# EAGLE board ComputeCalculator (EAGLE 7.2.0), part 1 of 2
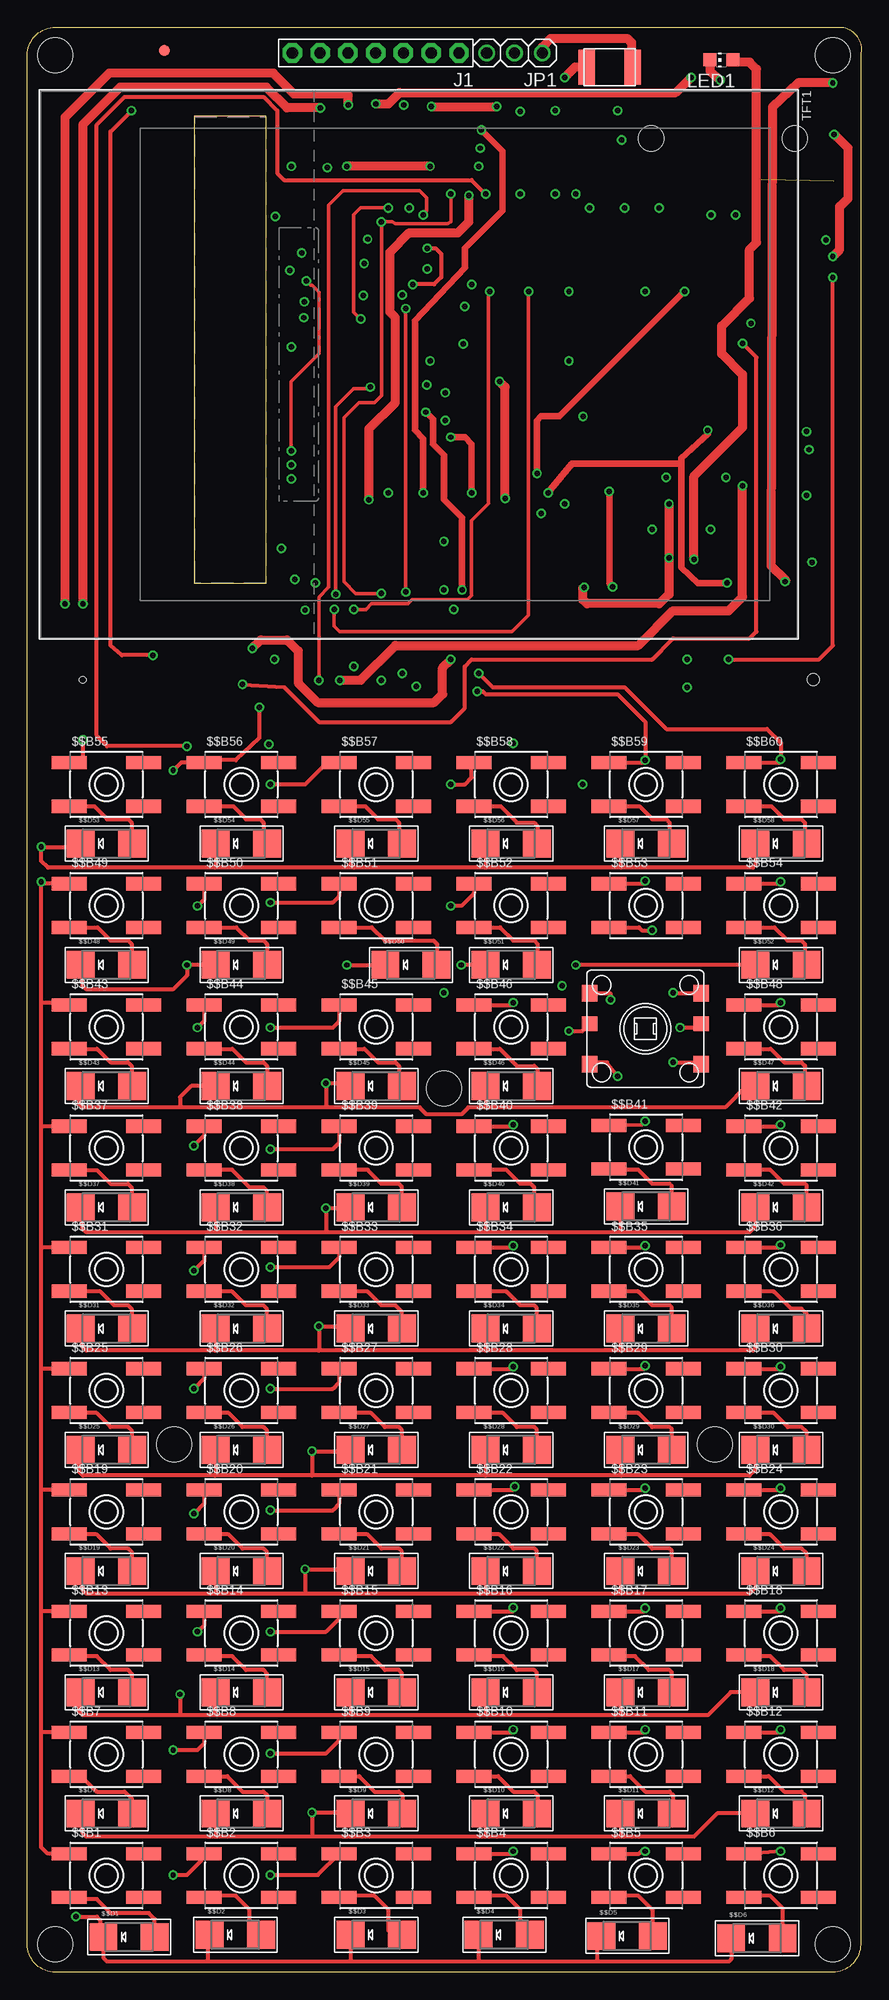
[diagram p5: board, top side]
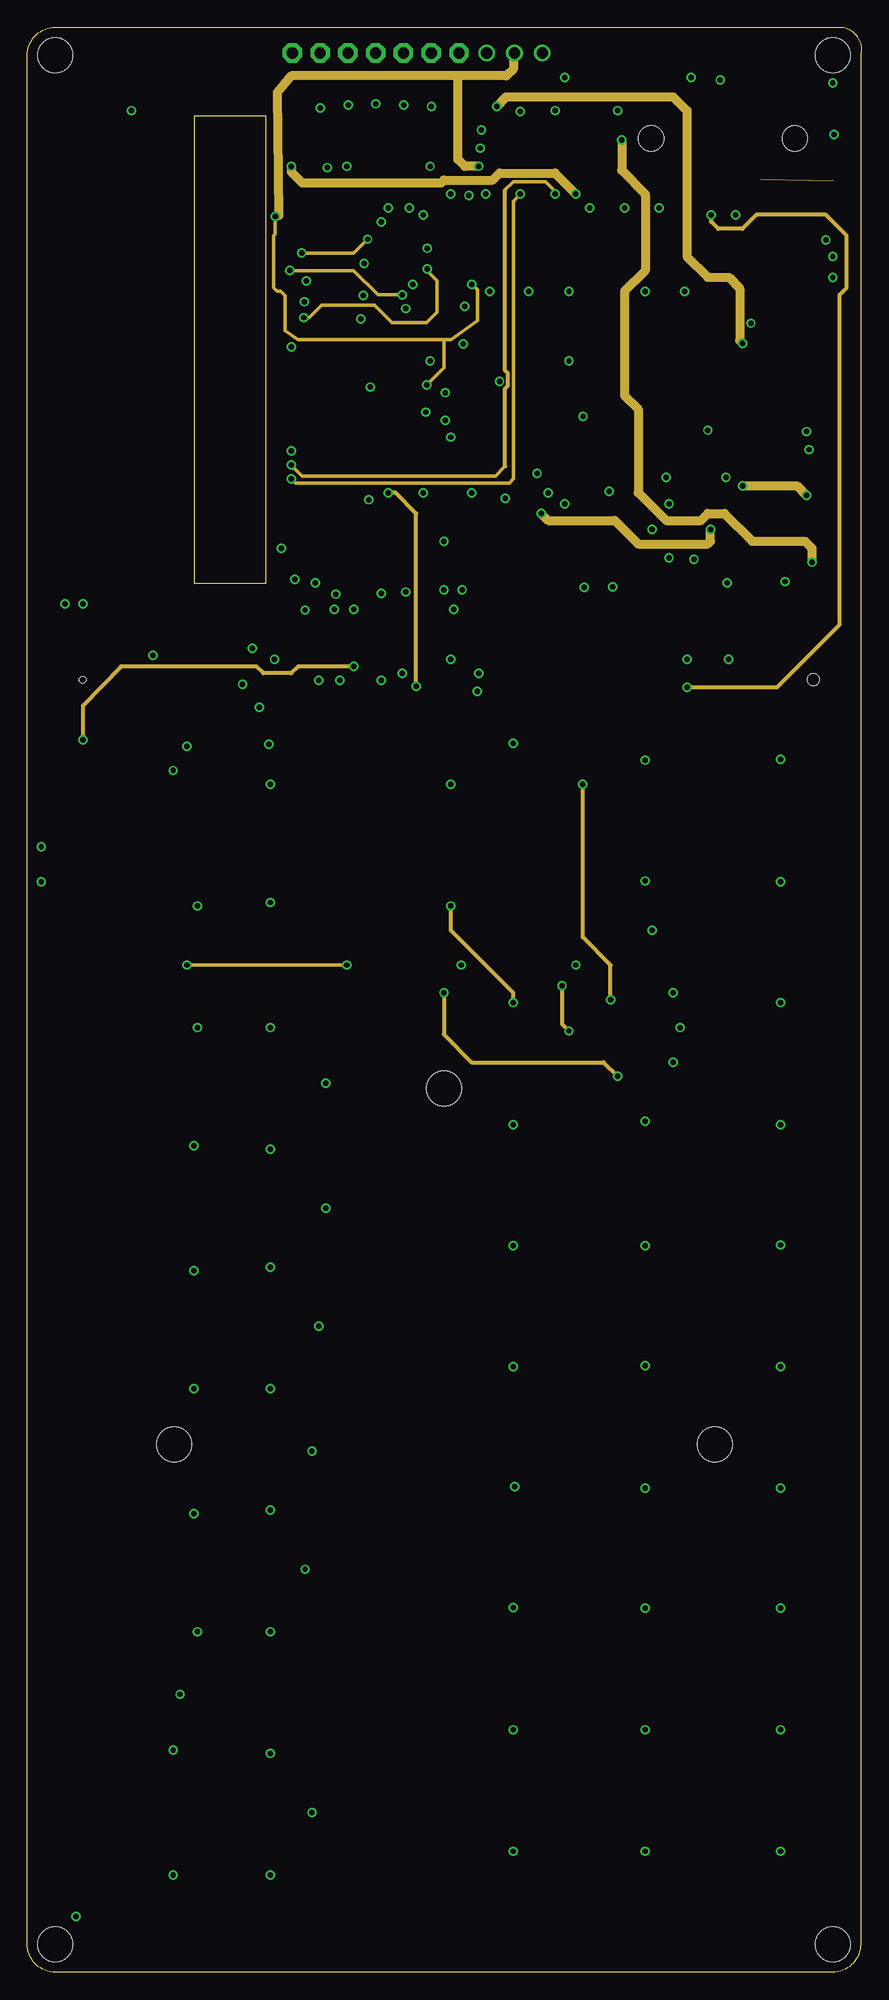
[diagram p6: board, inner layer Route2]
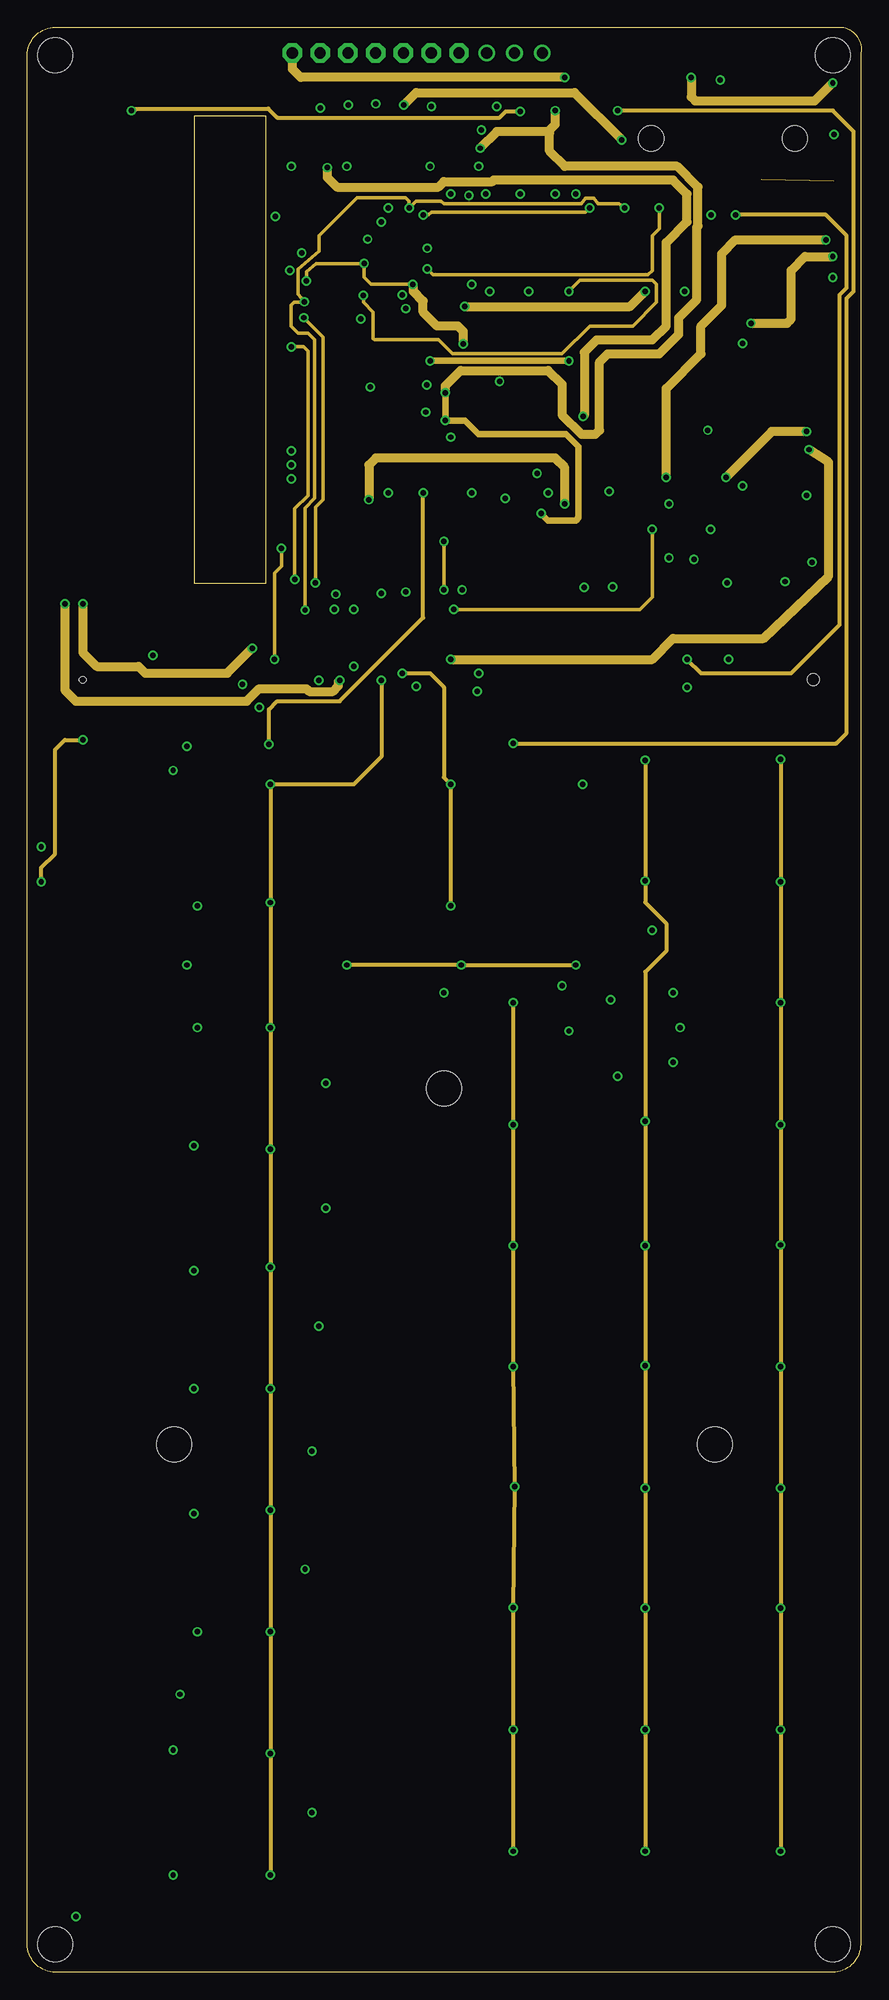
[diagram p7: board, inner layer Route15]
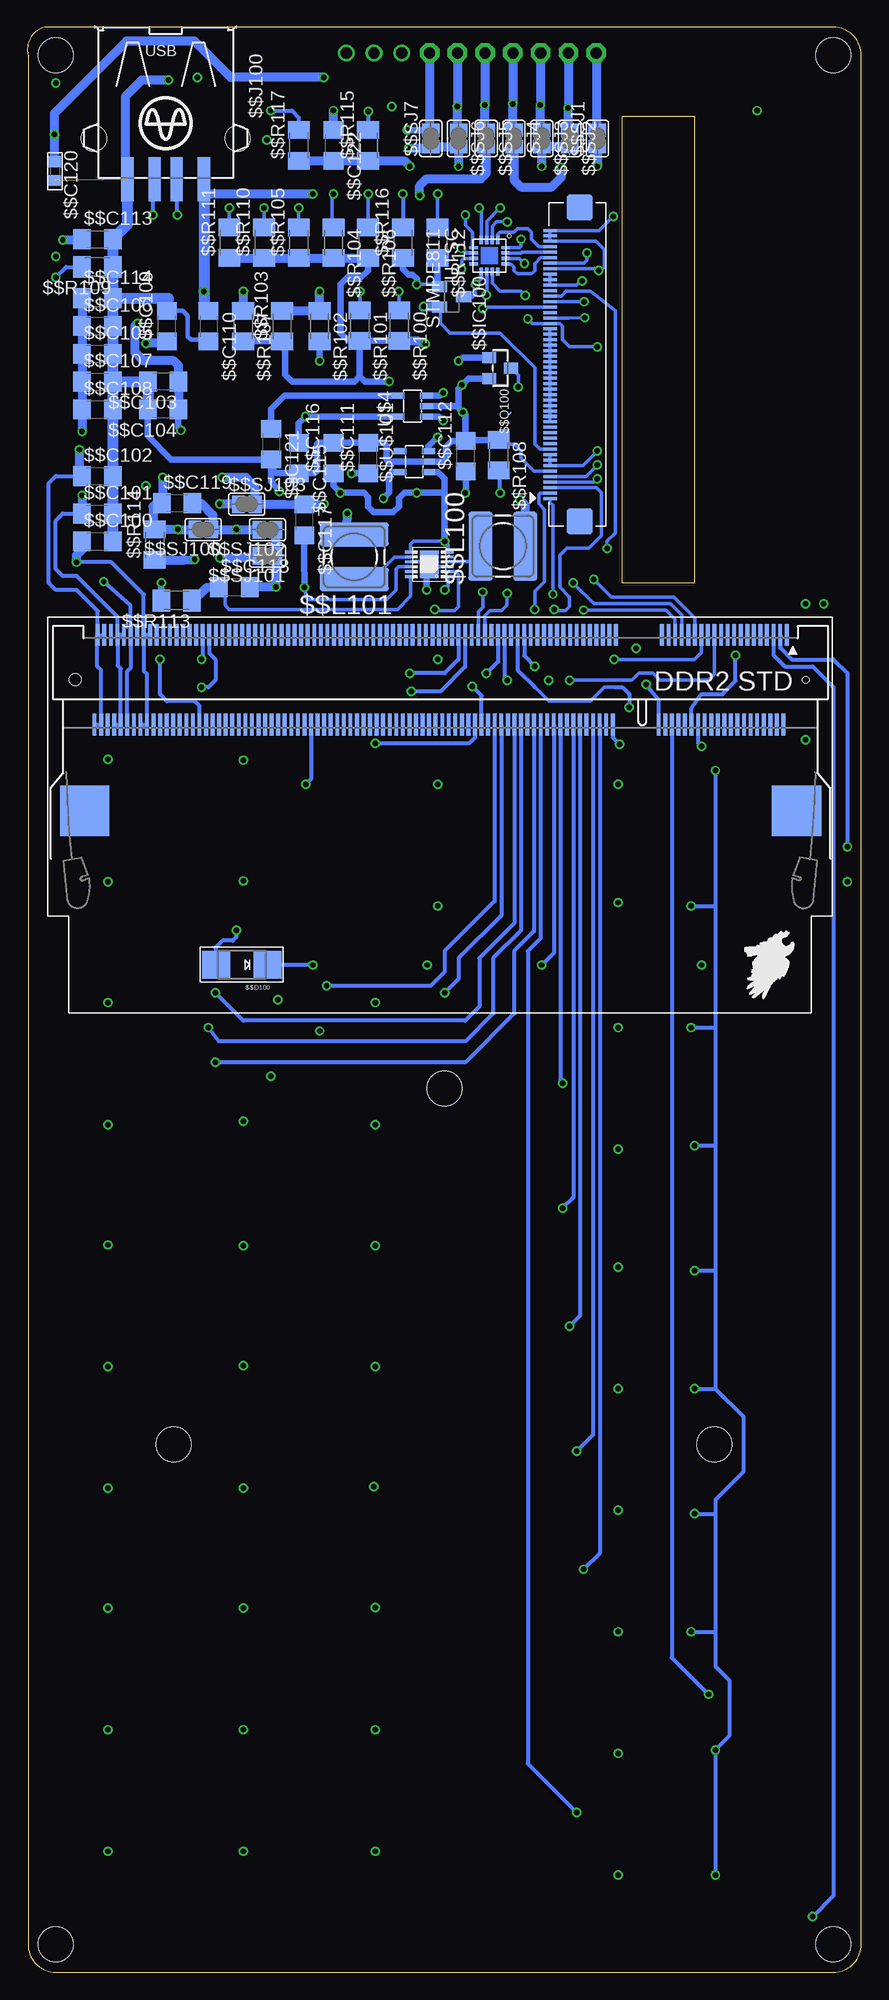
[diagram p8: board, bottom side, seen from below]

Size 76.26 x 177.8 mm. Coordinates in mm from the lower left corner, seen from the top.
Outline: 73.66,0 2.54,0 arc-90 0,2.54 0,175.26 arc-90 2.54,177.8 74.67,177.8 arc-90 76.2,175.26 76.2,2.54 arc-90 73.66,0
Copper layers (1*2*15*16): Top 0.035559375mm / dielectric 0.17018125mm / Route2 0.01778125mm / dielectric 47mil / Route15 0.01778125mm / dielectric 0.17018125mm / Bottom 0.035559375mm
Design rules "OSHPARK_LaenPCBOrder_4Layer": minimum track width 6mil, minimum drill 13mil, track to track 6mil, track to pad 6mil, pad to pad 6mil, via to via 6mil, smd to smd 6mil, copper to edge 15mil, drill to drill 6mil, minimum pad ring 7mil, minimum via ring 7mil, stop-mask expansion 3mil, vias tented up to drill 0mil, thermal gap 10mil
Holes 3.2 mm at 2.54,175.26 73.66,175.26 2.54,2.54 73.66,2.54 13.42,48.26 62.87,48.26 38.1,80.77

## Footprints (pad centres in the part's own frame; a part is rotated, then mirrored left to right if it is on the bottom)
EVQ-Q2 = smd 3.2 x 1.2: A -3.4,-2; A' 3.4,-2; B -3.4,2; B' 3.4,2
SKQU = smd 1.4 x 1.5: 1 -5.1,3.25; 3 -5.1,-3.25; 4 5.1,-3.25; 6 5.1,3.25 | smd 1.4 x 1.3: 2 -5.1,-0.45; 5 5.1,-0.45
C1206 = smd 1.6 x 1.8: 1 -1.4,0; 2 1.4,0
C0603 = smd 1 x 1.1: 1 -0.85,0; 2 0.85,0
SMADIODE = smd 2.54 x 2.54: A 2.349,0; C -2.349,0
SOT23 = smd 1 x 1.4: 1 -0.95,-1.1; 2 0.95,-1.1; 3 0,1.1
USB-A003 = smd 1.12 x 4: 1 -3.5,14; 2 -1,14; 3 1,14; 4 3.5,14 | hole 2.3: -6.57,10.28; 6.57,10.28
POWER-CHOKE_WE-TPC = smd 6.3 x 2.2: 1 0,2.05; 2 0,-2.05
RPI_COMPUTE = smd 0.35 x 2: 1 -31.38,-4.1; 2 -31.08,4.1; 3 -30.78,-4.1; 4 -30.48,4.1; 5 -30.18,-4.1; 6 -29.88,4.1; 7 -29.58,-4.1; 8 -29.28,4.1; 9 -28.98,-4.1; 10 -28.68,4.1; 11 -28.38,-4.1; 12 -28.08,4.1; 13 -27.78,-4.1; 14 -27.48,4.1; 15 -27.18,-4.1; 16 -26.88,4.1; 17 -26.58,-4.1; 18 -26.28,4.1; 19 -25.98,-4.1; 20 -25.68,4.1; 21 -25.38,-4.1; 22 -25.08,4.1; 23 -24.78,-4.1; 24 -24.48,4.1; 25 -24.18,-4.1; 26 -23.88,4.1; 27 -23.58,-4.1; 28 -23.28,4.1; 29 -22.98,-4.1; 30 -22.68,4.1; 31 -22.38,-4.1; 32 -22.08,4.1; 33 -21.78,-4.1; 34 -21.48,4.1; 35 -21.18,-4.1; 36 -20.88,4.1; 37 -20.58,-4.1; 38 -20.28,4.1; 39 -19.98,-4.1; 40 -19.68,4.1; 41 -15.78,-4.1; 42 -15.48,4.1; 43 -15.18,-4.1; 44 -14.88,4.1; 45 -14.58,-4.1; 46 -14.28,4.1; 47 -13.98,-4.1; 48 -13.68,4.1; 49 -13.38,-4.1; 50 -13.08,4.1; 51 -12.78,-4.1; 52 -12.48,4.1; 53 -12.18,-4.1; 54 -11.88,4.1; 55 -11.58,-4.1; 56 -11.28,4.1; 57 -10.98,-4.1; 58 -10.68,4.1; 59 -10.38,-4.1; 60 -10.08,4.1; 61 -9.78,-4.1; 62 -9.48,4.1; 63 -9.18,-4.1; 64 -8.88,4.1; 65 -8.58,-4.1; 66 -8.28,4.1; 67 -7.98,-4.1; 68 -7.68,4.1; 69 -7.38,-4.1; 70 -7.08,4.1; 71 -6.78,-4.1; 72 -6.48,4.1; 73 -6.18,-4.1; 74 -5.88,4.1; 75 -5.58,-4.1; 76 -5.28,4.1; 77 -4.98,-4.1; 78 -4.68,4.1; 79 -4.38,-4.1; 80 -4.08,4.1; 81 -3.78,-4.1; 82 -3.48,4.1; 83 -3.18,-4.1; 84 -2.88,4.1; 85 -2.58,-4.1; 86 -2.28,4.1; 87 -1.98,-4.1; 88 -1.68,4.1; 89 -1.38,-4.1; 90 -1.08,4.1; 91 -0.78,-4.1; 92 -0.48,4.1; 93 -0.18,-4.1; 94 0.12,4.1; 95 0.42,-4.1; 96 0.72,4.1; 97 1.02,-4.1; 98 1.32,4.1; 99 1.62,-4.1; 100 1.92,4.1; 101 2.22,-4.1; 102 2.52,4.1; 103 2.82,-4.1; 104 3.12,4.1; 105 3.42,-4.1; 106 3.72,4.1; 107 4.02,-4.1; 108 4.32,4.1; 109 4.62,-4.1; 110 4.92,4.1; 111 5.22,-4.1; 112 5.52,4.1; 113 5.82,-4.1; 114 6.12,4.1; 115 6.42,-4.1; 116 6.72,4.1; 117 7.02,-4.1; 118 7.32,4.1; 119 7.62,-4.1; 120 7.92,4.1; 121 8.22,-4.1; 122 8.52,4.1; 123 8.82,-4.1; 124 9.12,4.1; 125 9.42,-4.1; 126 9.72,4.1; 127 10.02,-4.1; 128 10.32,4.1; 129 10.62,-4.1; 130 10.92,4.1; 131 11.22,-4.1; 132 11.52,4.1; 133 11.82,-4.1; 134 12.12,4.1; 135 12.42,-4.1; 136 12.72,4.1; 137 13.02,-4.1; 138 13.32,4.1; 139 13.62,-4.1; 140 13.92,4.1; 141 14.22,-4.1; 142 14.52,4.1; 143 14.82,-4.1; 144 15.12,4.1; 145 15.42,-4.1; 146 15.72,4.1; 147 16.02,-4.1; 148 16.32,4.1; 149 16.62,-4.1; 150 16.92,4.1; 151 17.22,-4.1; 152 17.52,4.1; 153 17.82,-4.1; 154 18.12,4.1; 155 18.42,-4.1; 156 18.72,4.1; 157 19.02,-4.1; 158 19.32,4.1; 159 19.62,-4.1; 160 19.92,4.1; 161 20.22,-4.1; 162 20.52,4.1; 163 20.82,-4.1; 164 21.12,4.1; 165 21.42,-4.1; 166 21.72,4.1; 167 22.02,-4.1; 168 22.32,4.1; 169 22.62,-4.1; 170 22.92,4.1; 171 23.22,-4.1; 172 23.52,4.1; 173 23.82,-4.1; 174 24.12,4.1; 175 24.42,-4.1; 176 24.72,4.1; 177 25.02,-4.1; 178 25.32,4.1; 179 25.62,-4.1; 180 25.92,4.1; 181 26.22,-4.1; 182 26.52,4.1; 183 26.82,-4.1; 184 27.12,4.1; 185 27.42,-4.1; 186 27.72,4.1; 187 28.02,-4.1; 188 28.32,4.1; 189 28.62,-4.1; 190 28.92,4.1; 191 29.22,-4.1; 192 29.52,4.1; 193 29.82,-4.1; 194 30.12,4.1; 195 30.42,-4.1; 196 30.72,4.1; 197 31.02,-4.1; 198 31.32,4.1; 199 31.62,-4.1; 200 31.92,4.1 | smd 4.5 x 4.6: M1 -32.28,12; M2 32.82,12 | hole 0.6: -33.13,0 | hole 1.1: 33.67,0
SOT23-WIDE = smd 1 x 1.27: 1 -0.95,-1; 2 0.95,-1; 3 0,1
M1206 = smd 1.6 x 2: 1 -1.4,0; 2 1.4,0
SJW = smd 1.168 x 1.6: 1 -0.762,0; 2 0.762,0
FIDUCIAL_1MM = smd 1 x 1: 1 0,0
WDFN_12L = smd 1 x 0.25: 1 -1.7,1.125; 2 -1.7,0.675; 3 -1.7,0.225; 4 -1.7,-0.225; 5 -1.7,-0.675; 6 -1.7,-1.125; 7 1.7,-1.125; 8 1.7,-0.675; 9 1.7,-0.225; 10 1.7,0.225; 11 1.7,0.675; 12 1.7,1.125 | smd 1.7 x 2.5: 13 0,0
SOT-25 = smd 0.55 x 1.2: 1 -0.95,-1.3; 2 0,-1.3; 3 0.95,-1.3; 4 0.95,1.3; 5 -0.95,1.3
1X7-BIG = drill 1.016 pad 1.778 octagon: 1 -7.62,0; 2 -5.08,0; 3 -2.54,0; 4 0,0; 5 2.54,0; 6 5.08,0; 7 7.62,0
1X03 = drill 1.016: 1 -2.54,0; 2 0,0; 3 2.54,0
CHIP-LED0805 = smd 1.2 x 1.2: A 0,-1.05; C 0,1.05
TFT_CTP28 = smd 0.275 x 1.2 bottom: 1 12.25,-7.36; 2 11.75,-7.36; 3 11.25,-7.36; 4 10.75,-7.36; 5 10.25,-7.36; 6 9.75,-7.36; 7 9.25,-7.36; 8 8.75,-7.36; 9 8.25,-7.36; 10 7.75,-7.36; 11 7.25,-7.36; 12 6.75,-7.36; 13 6.25,-7.36; 14 5.75,-7.36; 15 5.25,-7.36; 16 4.75,-7.36; 17 4.25,-7.36; 18 3.75,-7.36; 19 3.25,-7.36; 20 2.75,-7.36; 21 2.25,-7.36; 22 1.75,-7.36; 23 1.25,-7.36; 24 0.75,-7.36; 25 0.25,-7.36; 26 -0.25,-7.36; 27 -0.75,-7.36; 28 -1.25,-7.36; 29 -1.75,-7.36; 30 -2.25,-7.36; 31 -2.75,-7.36; 32 -3.25,-7.36; 33 -3.75,-7.36; 34 -4.25,-7.36; 35 -4.75,-7.36; 36 -5.25,-7.36; 37 -5.75,-7.36; 38 -6.25,-7.36; 39 -6.75,-7.36; 40 -7.25,-7.36; 41 -7.75,-7.36; 42 -8.25,-7.36; 43 -8.75,-7.36; 44 -9.25,-7.36; 45 -9.75,-7.36; 46 -10.25,-7.36; 47 -10.75,-7.36; 48 -11.25,-7.36; 49 -11.75,-7.36; 50 -12.25,-7.36 | smd 2.4 x 2.4 bottom: PAD1 14.35,-10.06; PAD2 -14.35,-10.06
MF-MSMF200 = smd 1.5 x 3.2: P$1 -2.1,0; P$2 2.1,0
QFN16L = smd 0.75 x 0.3: 1 -1.45,0.75; 2 -1.45,0.25; 3 -1.45,-0.25; 4 -1.45,-0.75; 9 1.45,-0.75; 10 1.45,-0.25; 11 1.45,0.25; 12 1.45,0.75 | smd 0.3 x 0.75: 5 -0.75,-1.45; 6 -0.25,-1.45; 7 0.25,-1.45; 8 0.75,-1.45; 13 0.75,1.45; 14 0.25,1.45; 15 -0.25,1.45; 16 -0.75,1.45

## Placement (x,y rotation side)
$$B1  A9  [EVQ-Q2]  7.23,8.83 0 top
$$B2  B9  [EVQ-Q2]  19.57,8.83 0 top
$$B3  C9  [EVQ-Q2]  31.91,8.83 0 top
$$B4  D9  [EVQ-Q2]  44.24,8.83 0 top
$$B5  E9  [EVQ-Q2]  56.58,8.83 0 top
$$B6  F9  [EVQ-Q2]  68.92,8.83 0 top
$$B7  A8  [EVQ-Q2]  7.23,19.92 0 top
$$B8  B8  [EVQ-Q2]  19.57,19.92 0 top
$$B9  C8  [EVQ-Q2]  31.91,19.92 0 top
$$B10  D8  [EVQ-Q2]  44.24,19.92 0 top
$$B11  E8  [EVQ-Q2]  56.58,19.92 0 top
$$B12  F8  [EVQ-Q2]  68.92,19.92 0 top
$$B13  A7  [EVQ-Q2]  7.23,31 0 top
$$B14  B7  [EVQ-Q2]  19.57,31 0 top
$$B15  C7  [EVQ-Q2]  31.91,31 0 top
$$B16  D7  [EVQ-Q2]  44.24,31 0 top
$$B17  E7  [EVQ-Q2]  56.58,31 0 top
$$B18  F7  [EVQ-Q2]  68.92,31 0 top
$$B19  A6  [EVQ-Q2]  7.23,42.09 0 top
$$B20  B6  [EVQ-Q2]  19.57,42.09 0 top
$$B21  C6  [EVQ-Q2]  31.91,42.09 0 top
$$B22  D6  [EVQ-Q2]  44.24,42.09 0 top
$$B23  E6  [EVQ-Q2]  56.58,42.09 0 top
$$B24  F6  [EVQ-Q2]  68.92,42.09 0 top
$$B25  A5  [EVQ-Q2]  7.23,53.17 0 top
$$B26  B5  [EVQ-Q2]  19.57,53.17 0 top
$$B27  C5  [EVQ-Q2]  31.91,53.17 0 top
$$B28  D5  [EVQ-Q2]  44.24,53.17 0 top
$$B29  E5  [EVQ-Q2]  56.58,53.17 0 top
$$B30  F5\  [EVQ-Q2]  68.92,53.17 0 top
$$B31  A4  [EVQ-Q2]  7.23,64.25 0 top
$$B32  B4  [EVQ-Q2]  19.57,64.25 0 top
$$B33  C4  [EVQ-Q2]  31.91,64.25 0 top
$$B34  D4  [EVQ-Q2]  44.24,64.25 0 top
$$B35  E4  [EVQ-Q2]  56.58,64.25 0 top
$$B36  F4  [EVQ-Q2]  68.92,64.25 0 top
$$B37  A3  [EVQ-Q2]  7.23,75.34 0 top
$$B38  B3  [EVQ-Q2]  19.57,75.34 0 top
$$B39  C3  [EVQ-Q2]  31.91,75.34 0 top
$$B40  D3  [EVQ-Q2]  44.24,75.34 0 top
$$B41  E3  [EVQ-Q2]  56.58,75.42 0 top
$$B42  F3  [EVQ-Q2]  68.92,75.34 0 top
$$B43  A2  [EVQ-Q2]  7.23,86.42 0 top
$$B44  B2  [EVQ-Q2]  19.57,86.42 0 top
$$B45  C2  [EVQ-Q2]  31.91,86.42 0 top
$$B46  D2  [EVQ-Q2]  44.24,86.42 0 top
$$B47  SKQU  [SKQU]  56.51,86.25 180 top
$$B48  F2  [EVQ-Q2]  68.92,86.42 0 top
$$B49  A1  [EVQ-Q2]  7.23,97.5 0 top
$$B50  B1  [EVQ-Q2]  19.57,97.5 0 top
$$B51  C1  [EVQ-Q2]  31.91,97.5 0 top
$$B52  D1  [EVQ-Q2]  44.24,97.5 0 top
$$B53  E1  [EVQ-Q2]  56.58,97.5 0 top
$$B54  F1  [EVQ-Q2]  68.92,97.5 0 top
$$B55  A0  [EVQ-Q2]  7.23,108.59 0 top
$$B56  B0  [EVQ-Q2]  19.57,108.59 0 top
$$B57  C0  [EVQ-Q2]  31.91,108.59 0 top
$$B58  D0  [EVQ-Q2]  44.24,108.59 0 top
$$B59  E0  [EVQ-Q2]  56.58,108.59 0 top
$$B60  F0  [EVQ-Q2]  68.92,108.59 0 top
$$C100  47uF  [C1206]  69.85,130.81 0 bottom
$$C101  47uF  [C1206]  69.85,133.35 0 bottom
$$C102  47uF  [C1206]  69.85,136.78 0 bottom
$$C103  10uF  [C1206]  63.83,145.42 180 bottom
$$C104  10uF  [C1206]  63.85,142.88 180 bottom
$$C105  1uF  [C1206]  69.85,147.96 0 bottom
$$C106  0.1uF  [C1206]  69.85,150.5 0 bottom
$$C107  0.1uF  [C1206]  69.85,145.42 0 bottom
$$C108  0.1uF  [C1206]  69.85,142.88 0 bottom
$$C109  1uF  [C1206]  63.5,150.5 90 bottom
$$C110  47uF  [C1206]  59.69,150.5 270 bottom
$$C111  47uF  [C1206]  45.09,138.43 90 bottom
$$C112  1uF  [C1206]  36.16,138.6 90 bottom
$$C113  10uF  [C1206]  69.85,158.43 0 bottom
$$C114  10uF  [C1206]  69.85,153.04 0 bottom
$$C115  4.7uF  [C1206]  51.44,138.43 270 bottom
$$C116  10uF  [C1206]  48.26,138.43 90 bottom
$$C117  NF  [C1206]  50.94,132.77 270 bottom
$$C118  100nF  [C1206]  57.33,126.62 0 bottom
$$C119  NF  [C1206]  62.58,134.3 0 bottom
$$C120  47uF  [C0603]  73.74,164.65 270 bottom
$$C121  100nF  [C1206]  53.98,139.7 270 bottom
$$C122  10uF  [C1206]  48.26,167 270 bottom
$$D1  [SMADIODE]  9.31,3.21 0 top
$$D2  [SMADIODE]  19.02,3.42 0 top
$$D3  [SMADIODE]  31.91,3.42 0 top
$$D4  [SMADIODE]  43.61,3.42 0 top
$$D5  [SMADIODE]  54.85,3.31 0 top
$$D6  [SMADIODE]  66.72,3.1 0 top
$$D7  [SMADIODE]  7.23,14.51 0 top
$$D8  [SMADIODE]  19.57,14.51 0 top
$$D9  [SMADIODE]  31.91,14.51 0 top
$$D10  [SMADIODE]  44.24,14.51 0 top
$$D11  [SMADIODE]  56.58,14.51 0 top
$$D12  [SMADIODE]  68.92,14.51 0 top
$$D13  [SMADIODE]  7.23,25.59 0 top
$$D14  [SMADIODE]  19.57,25.59 0 top
$$D15  [SMADIODE]  31.91,25.59 0 top
$$D16  [SMADIODE]  44.24,25.59 0 top
$$D17  [SMADIODE]  56.58,25.59 0 top
$$D18  [SMADIODE]  68.92,25.59 0 top
$$D19  [SMADIODE]  7.23,36.67 0 top
$$D20  [SMADIODE]  19.57,36.67 0 top
$$D21  [SMADIODE]  31.91,36.67 0 top
$$D22  [SMADIODE]  44.24,36.67 0 top
$$D23  [SMADIODE]  56.58,36.67 0 top
$$D24  [SMADIODE]  68.92,36.67 0 top
$$D25  [SMADIODE]  7.23,47.76 0 top
$$D26  [SMADIODE]  19.57,47.76 0 top
$$D27  [SMADIODE]  31.91,47.76 0 top
$$D28  [SMADIODE]  44.24,47.76 0 top
$$D29  [SMADIODE]  56.58,47.76 0 top
$$D30  [SMADIODE]  68.92,47.76 0 top
$$D31  [SMADIODE]  7.23,58.84 0 top
$$D32  [SMADIODE]  19.57,58.84 0 top
$$D33  [SMADIODE]  31.91,58.84 0 top
$$D34  [SMADIODE]  44.24,58.84 0 top
$$D35  [SMADIODE]  56.58,58.84 0 top
$$D36  [SMADIODE]  68.92,58.84 0 top
$$D37  [SMADIODE]  7.23,69.92 0 top
$$D38  [SMADIODE]  19.57,69.92 0 top
$$D39  [SMADIODE]  31.91,69.92 0 top
$$D40  [SMADIODE]  44.24,69.92 0 top
$$D41  [SMADIODE]  56.58,70.01 0 top
$$D42  [SMADIODE]  68.92,69.92 0 top
$$D43  [SMADIODE]  7.23,81.01 0 top
$$D44  [SMADIODE]  19.57,81.01 0 top
$$D45  [SMADIODE]  31.91,81.01 0 top
$$D46  [SMADIODE]  44.24,81.01 0 top
$$D47  [SMADIODE]  68.92,81.01 0 top
$$D48  [SMADIODE]  7.23,92.09 0 top
$$D49  [SMADIODE]  19.57,92.09 0 top
$$D50  [SMADIODE]  35.08,92.09 0 top
$$D51  [SMADIODE]  44.24,92.09 0 top
$$D52  [SMADIODE]  68.92,92.09 0 top
$$D53  [SMADIODE]  7.23,103.18 0 top
$$D54  [SMADIODE]  19.57,103.18 0 top
$$D55  [SMADIODE]  31.91,103.18 0 top
$$D56  [SMADIODE]  44.24,103.18 0 top
$$D57  [SMADIODE]  56.58,103.18 0 top
$$D58  [SMADIODE]  68.92,103.18 0 top
$$D100  [SMADIODE]  56.64,92.1 180 bottom
$$IC100  MAXP803  [SOT23]  37.47,153.16 270 bottom
$$J100  61400416021  [USB-A003]  63.61,177.93 180 bottom
$$L100  SRN4018-4R7M  [POWER-CHOKE_WE-TPC]  32.77,130.37 90 bottom
$$L101  SRN4018-4R7M  [POWER-CHOKE_WE-TPC]  46.38,129.39 180 bottom
$$PCB100  RPI_COMPUTE  [RPI_COMPUTE]  38.2,118.16 180 bottom
$$Q100  MMBT2222  [SOT23-WIDE]  33.02,146.65 270 bottom
$$R100  100  [M1206]  42.25,150.54 270 bottom
$$R101  100  [M1206]  45.87,150.53 270 bottom
$$R102  1K  [M1206]  49.53,150.5 270 bottom
$$R103  1K  [M1206]  52.96,150.5 90 bottom
$$R104  100  [M1206]  48.26,158.12 270 bottom
$$R105  10K  [M1206]  51.44,158.12 90 bottom
$$R106  100  [M1206]  45.09,158.12 270 bottom
$$R107  100  [M1206]  56.52,150.5 270 bottom
$$R108  100KΩ 1%  [M1206]  33.15,138.68 270 bottom
$$R109  100KΩ 1%  [M1206]  69.85,155.89 180 bottom
$$R110  22  [M1206]  54.61,158.12 90 bottom
$$R111  22  [M1206]  57.78,158.12 90 bottom
$$R112  10K  [M1206]  38.73,158.12 270 bottom
$$R113  100KΩ 1%  [M1206]  62.62,125.41 180 bottom
$$R114  470Ω 1%  [M1206]  64.6,130.5 90 bottom
$$R115  100KΩ 1%  [M1206]  45.09,167 90 bottom
$$R116  100KΩ 1%  [M1206]  41.91,158.12 90 bottom
$$R117  100KΩ 1%  [M1206]  51.44,167 90 bottom
$$SJ1  [SJW]  24.13,167.64 90 bottom
$$SJ2  [SJW]  26.67,167.64 270 bottom
$$SJ3  [SJW]  29.21,167.64 270 bottom
$$SJ5  [SJW]  34.29,167.64 270 bottom
$$SJ6  [SJW]  36.83,167.64 270 bottom
$$SJ7  [SJW]  39.37,167.64 90 bottom
$$SJ100  [SJW]  60.17,131.89 180 bottom
$$SJ101  [SJW]  54.3,129.47 180 bottom
$$SJ102  [SJW]  54.3,131.87 180 bottom
$$SJ103  [SJW]  56.2,134.21 0 bottom
$$U$1  FIDUCIAL  [FIDUCIAL_1MM]  12.54,175.69 0 top
$$U$100  PAM2306AYPKE  [WDFN_12L]  39.51,128.71 180 bottom
$$U$101  MIC5225  [SOT-25]  40.88,138.09 90 bottom
J1  Power  [1X7-BIG]  31.86,175.46 180 top
JP1  [1X03]  44.55,175.46 180 top
LED1  RED  [CHIP-LED0805]  63.48,174.82 90 top
SJ4  [SJW]  31.75,167.64 270 bottom
TFT1  [TFT_CTP28]  35.81,146.98 270 top
U$3  MF-MSMF200  [MF-MSMF200]  53.25,174.16 180 top
U$4  AP7115-25SEG  [SOT-25]  41.05,143.18 90 bottom
UTSC  STMPE811  [QFN16L]  34,156.92 270 bottom